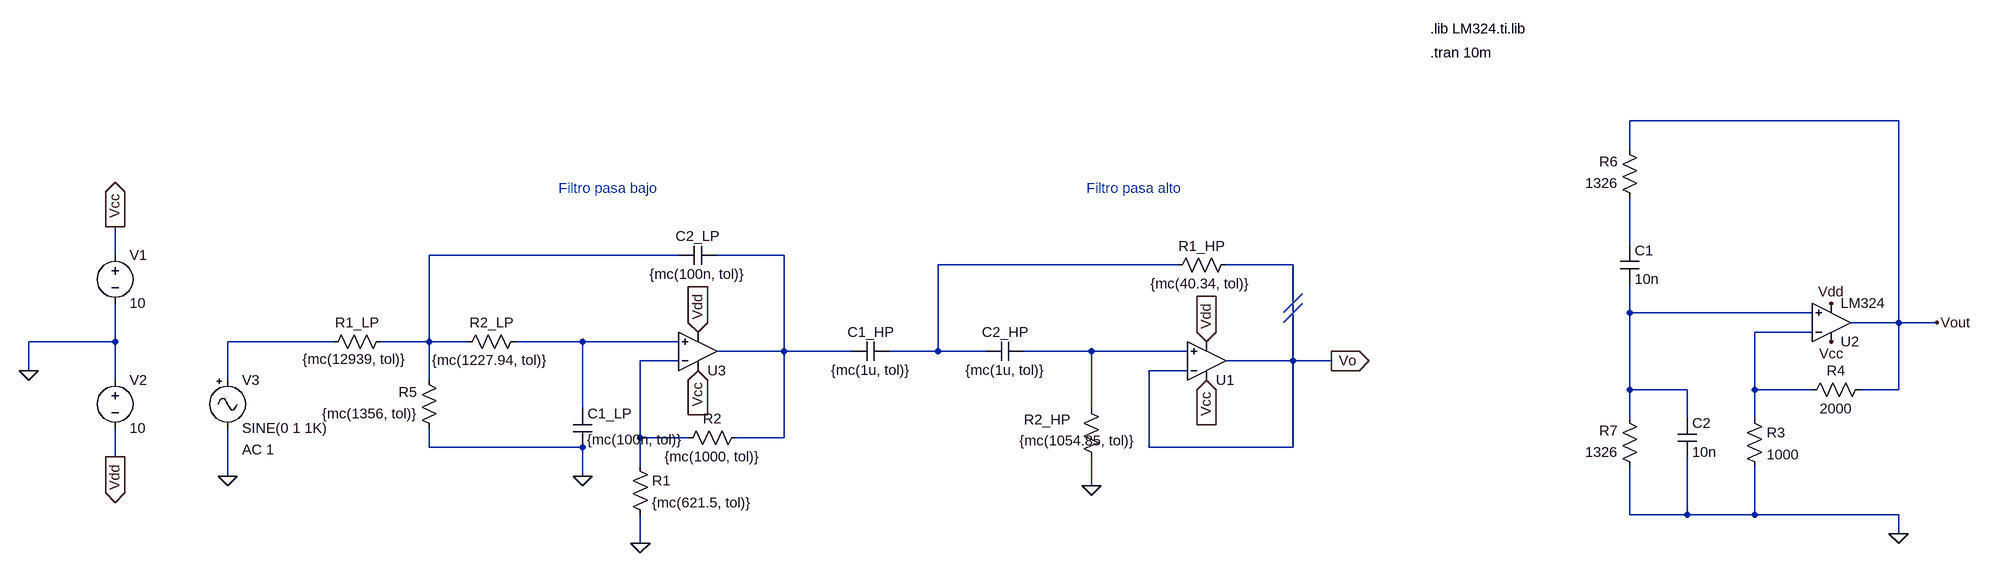
[diagram p0: schematic Sim_Filtro.asc]
Sim_Filtro.asc, the LTspice schematic file:
Version 4
SHEET 1 4928 2212
WIRE 3264 336 2816 336
WIRE 2816 384 2816 336
WIRE 2816 544 2816 464
WIRE -704 560 -704 512
WIRE 272 560 -144 560
WIRE 448 560 336 560
WIRE 1104 576 704 576
WIRE 1296 576 1184 576
WIRE 2816 656 2816 608
WIRE 3120 656 2816 656
WIRE 3264 672 3264 336
WIRE 3264 672 3184 672
WIRE 3328 672 3264 672
WIRE 3120 688 3024 688
WIRE -704 704 -704 640
WIRE -704 704 -848 704
WIRE -304 704 -480 704
WIRE -144 704 -144 560
WIRE -144 704 -224 704
WIRE -80 704 -144 704
WIRE 112 704 0 704
WIRE 272 704 112 704
WIRE 448 720 448 560
WIRE 448 720 336 720
WIRE 560 720 448 720
WIRE 704 720 704 576
WIRE 704 720 624 720
WIRE 784 720 704 720
WIRE 960 720 848 720
WIRE 1120 720 960 720
WIRE 272 736 208 736
WIRE 1296 736 1296 576
WIRE 1296 736 1184 736
WIRE 1360 736 1296 736
WIRE -848 752 -848 704
WIRE 1120 752 1056 752
WIRE -704 768 -704 704
WIRE -480 768 -480 704
WIRE -144 768 -144 704
WIRE 2816 784 2816 656
WIRE 2912 784 2816 784
WIRE 3024 784 3024 688
WIRE 3120 784 3024 784
WIRE 3264 784 3264 672
WIRE 3264 784 3200 784
WIRE 112 816 112 704
WIRE 960 816 960 720
WIRE 2816 832 2816 784
WIRE 2912 832 2912 784
WIRE 3024 832 3024 784
WIRE 208 864 208 736
WIRE 288 864 208 864
WIRE 448 864 448 720
WIRE 448 864 368 864
WIRE -144 880 -144 848
WIRE 112 880 -144 880
WIRE 1056 880 1056 752
WIRE 1296 880 1296 736
WIRE 1296 880 1056 880
WIRE -704 896 -704 848
WIRE 208 912 208 864
WIRE -480 928 -480 848
WIRE 112 928 112 880
WIRE 960 944 960 896
WIRE 2816 992 2816 912
WIRE 2912 992 2912 896
WIRE 2912 992 2816 992
WIRE 3024 992 3024 912
WIRE 3024 992 2912 992
WIRE 3264 992 3024 992
WIRE 3264 1024 3264 992
WIRE 208 1040 208 992
FLAG 112 928 0
FLAG 960 944 0
FLAG -848 752 0
FLAG -704 512 Vcc
IOPIN -704 512 Out
FLAG -704 896 Vdd
IOPIN -704 896 Out
FLAG 304 752 Vcc
IOPIN 304 752 In
FLAG 304 688 Vdd
IOPIN 304 688 In
FLAG 1152 704 Vdd
IOPIN 1152 704 In
FLAG 1152 768 Vcc
IOPIN 1152 768 In
FLAG -480 928 0
FLAG 208 1040 0
FLAG 1360 736 Vo
IOPIN 1360 736 Out
FLAG 3264 1024 0
FLAG 3152 704 Vcc
FLAG 3152 640 Vdd
FLAG 3328 672 Vout
SYMBOL res -96 720 R270
WINDOW 0 32 56 VTop 2
WINDOW 3 -30 53 VTop 2
SYMATTR InstName R2_LP
SYMATTR Value {mc(1227.94, tol)}
SYMBOL res -320 720 R270
WINDOW 0 32 56 VTop 2
WINDOW 3 -29 51 VTop 2
SYMATTR InstName R1_LP
SYMATTR Value {mc(12939, tol)}
SYMBOL cap 96 816 R0
WINDOW 3 23 51 Left 2
SYMATTR Value {mc(100n, tol)}
SYMATTR InstName C1_LP
SYMBOL cap 336 544 R90
WINDOW 0 0 32 VBottom 2
WINDOW 3 63 33 VBottom 2
SYMATTR InstName C2_LP
SYMATTR Value {mc(100n, tol)}
SYMBOL cap 560 736 R270
WINDOW 0 32 32 VTop 2
WINDOW 3 0 32 VBottom 2
SYMATTR InstName C1_HP
SYMATTR Value {mc(1u, tol)}
SYMBOL cap 784 736 R270
WINDOW 0 32 32 VTop 2
WINDOW 3 0 32 VBottom 2
SYMATTR InstName C2_HP
SYMATTR Value {mc(1u, tol)}
SYMBOL res 1200 560 R90
WINDOW 0 0 56 VBottom 2
WINDOW 3 63 59 VBottom 2
SYMATTR InstName R1_HP
SYMATTR Value {mc(40.34, tol)}
SYMBOL res 944 800 R0
WINDOW 0 -96 34 Left 2
WINDOW 3 -104 69 Left 2
SYMATTR InstName R2_HP
SYMATTR Value {mc(1054.85, tol)}
SYMBOL voltage -704 544 R0
WINDOW 123 0 0 Left 0
WINDOW 39 0 0 Left 0
SYMATTR InstName V1
SYMATTR Value 10
SYMBOL voltage -704 752 R0
WINDOW 123 0 0 Left 0
WINDOW 39 0 0 Left 0
SYMATTR InstName V2
SYMATTR Value 10
SYMBOL Misc\\signal -480 752 R0
WINDOW 123 24 132 Left 2
WINDOW 39 0 0 Left 0
SYMATTR Value2 AC 1
SYMATTR InstName V3
SYMBOL OpAmps\\UniversalOpAmp2 304 720 M180
SYMATTR InstName U3
SYMBOL OpAmps\\UniversalOpAmp2 1152 736 M180
SYMATTR InstName U1
SYMBOL res -128 864 R180
WINDOW 0 36 76 Left 2
WINDOW 3 36 40 Left 2
SYMATTR InstName R5
SYMATTR Value {mc(1356, tol)}
SYMBOL res 192 896 R0
SYMATTR InstName R1
SYMATTR Value {mc(621.5, tol)}
SYMBOL res 384 848 R90
WINDOW 0 0 56 VBottom 2
WINDOW 3 32 56 VTop 2
SYMATTR InstName R2
SYMATTR Value {mc(1000, tol)}
SYMBOL OpAmps\\opamp2 3152 736 M180
SYMATTR InstName U2
SYMATTR Value LM324
SYMBOL res 3008 816 R0
SYMATTR InstName R3
SYMATTR Value 1000
SYMBOL res 3216 768 R90
WINDOW 0 0 56 VBottom 2
WINDOW 3 32 56 VTop 2
SYMATTR InstName R4
SYMATTR Value 2000
SYMBOL res 2832 480 R180
WINDOW 0 36 76 Left 2
WINDOW 3 36 40 Left 2
SYMATTR InstName R6
SYMATTR Value 1326
SYMBOL res 2832 928 R180
WINDOW 0 36 76 Left 2
WINDOW 3 36 40 Left 2
SYMATTR InstName R7
SYMATTR Value 1326
SYMBOL cap 2800 544 R0
SYMATTR InstName C1
SYMATTR Value 10n
SYMBOL cap 2896 832 R0
SYMATTR InstName C2
SYMATTR Value 10n
TEXT 72 448 Left 2 ;Filtro pasa bajo
TEXT 952 448 Left 2 ;Filtro pasa alto
TEXT 2352 -168 Left 2 !.lib LM324.ti.lib
TEXT 2352 -128 Left 2 !.tran 10m
LINE Normal 1312 624 1280 656
LINE Normal 1312 640 1280 672

The netlist it stands for:
* Sim_Filtro.asc
R2_LP N002 N008 {mc(1227.94, tol)}
R1_LP N007 N002 {mc(12939, tol)}
C1_LP N008 0 {mc(100n, tol)}
C2_LP N003 N002 {mc(100n, tol)}
C1_HP N003 N004 {mc(1u, tol)}
C2_HP N004 N009 {mc(1u, tol)}
R1_HP Vo N004 {mc(40.34, tol)}
R2_HP N009 0 {mc(1054.85, tol)}
V1 Vcc 0 10
V2 0 Vdd 10
V3 N007 0 SINE(0 1 1K) AC 1
XU3 N008 N010 Vcc Vdd N003 level2 Avol=1Meg GBW=10Meg Slew=10Meg Ilimit=25m Rail=0 Vos=0 En=0 Enk=0 In=0 Ink=0 Rin=500Meg  ; pins In+ In- V+ V- OUT
XU1 N009 Vo Vcc Vdd Vo level2 Avol=1Meg GBW=10Meg Slew=10Meg Ilimit=25m Rail=0 Vos=0 En=0 Enk=0 In=0 Ink=0 Rin=500Meg  ; pins In+ In- V+ V- OUT
R5 0 N002 {mc(1356, tol)}
R1 N010 0 {mc(621.5, tol)}
R2 N003 N010 {mc(1000, tol)}
XU2 N005 N006 Vcc Vdd Vout LM324  ; pins In+ In- V+ V- OUT
R3 N006 0 1000
R4 Vout N006 2000
R6 N001 Vout 1326
R7 0 N005 1326
C1 N001 N005 10n
C2 N005 0 10n
* Filtro pasa bajo
* Filtro pasa alto
.lib LM324.ti.lib
.tran 10m
.lib UniversalOpAmp2.lib
.backanno
.end